# Altium schematic sheet IO_Ethernet.schdoc
size 265 x 180 mm
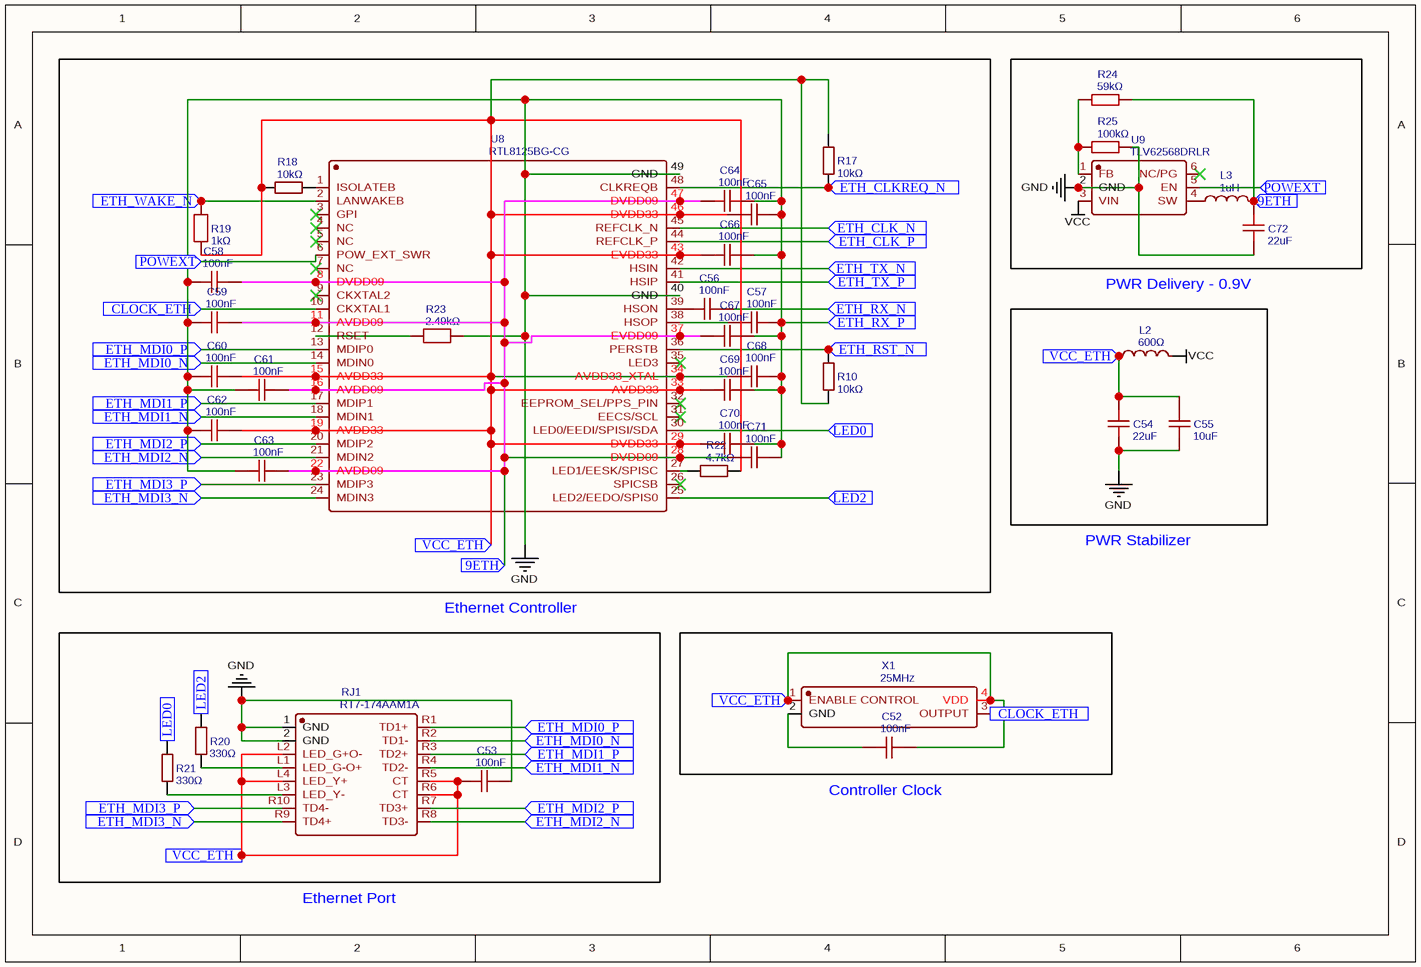
[diagram p0: IO_Ethernet.schdoc]

## Parts
C52  100nF  [C0402]
C53  100nF  [C0402]
C54  22uF  [C0805]
C55  10uF  [C0805]
C56  100nF  [C0402]
C57  100nF  [C0402]
C58  100nF  [C0402]
C59  100nF  [C0402]
C60  100nF  [C0402]
C61  100nF  [C0402]
C62  100nF  [C0402]
C63  100nF  [C0402]
C64  100nF  [C0402]
C65  100nF  [C0402]
C66  100nF  [C0402]
C67  100nF  [C0402]
C68  100nF  [C0402]
C69  100nF  [C0402]
C70  100nF  [C0402]
C71  100nF  [C0402]
C72  22uF  [C0805]
L2  600Ω  [L0805]
L3  1uH  [IND-SMD_L2.0-W1.6-B]
R10  10kΩ  [R0402]
R17  10kΩ  [R0402]
R18  10kΩ  [R0402]
R19  1kΩ  [R0402]
R20  330Ω  [R0402]
R21  330Ω  [R0402]
R22  4.7kΩ  [R0402]
R23  2.49kΩ  [R0402]
R24  59kΩ  [R0603]
R25  100kΩ  [R0603]
RJ1  RT7-174AAM1A  [RJ45-TH_RT7-174AAM1A]
U8  RTL8125BG-CG  [TQFN-48_L6.0-W6.0-P0.40-BL-EP4.5]
U9  TLV62568DRLR  [SOT-563_L1.6-W1.2-P0.50-LS1.6-BL]
X1  25MHz  [OSC-SMD_4P-L3.2-W2.5-BL_SG-8018CE]

## Blocks framed on the sheet
PWR Delivery - 0.9V: C54 C55 L2
Ethernet Controller: C53 R20 R21 RJ1

## Ports
9ETH (in), CLOCK_ETH (in), ETH_CLK_N (in), ETH_CLK_P (in), ETH_CLKREQ_N (in), ETH_MDI0_N (in), ETH_MDI0_P (in), ETH_MDI1_N (in), ETH_MDI1_P (in), ETH_MDI2_N (in), ETH_MDI2_P (in), ETH_MDI3_N (in), ETH_MDI3_P (in), ETH_RST_N (in), ETH_RX_N (in), ETH_RX_P (in), ETH_TX_N (in), ETH_TX_P (in), ETH_WAKE_N (in), LED0 (in), LED2 (in), POWEXT (in), VCC_ETH (in)

## Nets
GND: C53.2 C54.1 C55.1 C57.2 C58.2 C59.1 C60.1 C61.1 C62.1 C63.1 C64.2 C65.2 C66.2 C67.2 C68.2 C69.2 C70.2 C71.2 C72.1 R23.1 R25.2 RJ1.1(GND) RJ1.2(GND) U8.40(GND) U8.49(GND) U9.2(GND) ; port ETH_RX_P
VCC: L2.2 U9.3(VIN)
9ETH: C58.1 C59.2 C61.2 C63.2 C64.1 C67.1 C71.1 C72.2 L3.2 R24.2 U8.8(DVDD09) U8.11(AVDD09) U8.16(AVDD09) U8.22(AVDD09) U8.28(DVDD09) U8.37(EVDD09) U8.47(DVDD09) ; port 9ETH
CLOCK_ETH: U8.10(CKXTAL1) X1.3(OUTPUT) ; port CLOCK_ETH
ETH_CLK_N: U8.45(REFCLK_N) ; port ETH_CLK_N
ETH_CLK_P: U8.44(REFCLK_P) ; port ETH_CLK_P
ETH_CLKREQ_N: R17.1 U8.48(CLKREQB) ; port ETH_CLKREQ_N
ETH_MDI0_N: RJ1.R2(TD1-) U8.14(MDIN0) ; port ETH_MDI0_N
ETH_MDI0_P: RJ1.R1(TD1+) U8.13(MDIP0) ; port ETH_MDI0_P
ETH_MDI1_N: RJ1.R4(TD2-) U8.18(MDIN1) ; port ETH_MDI1_N
ETH_MDI1_P: RJ1.R3(TD2+) U8.17(MDIP1) ; port ETH_MDI1_P
ETH_MDI2_N: RJ1.R8(TD3-) U8.21(MDIN2) ; port ETH_MDI2_N
ETH_MDI2_P: RJ1.R7(TD3+) U8.20(MDIP2) ; port ETH_MDI2_P
ETH_MDI3_N: RJ1.R9(TD4+) U8.24(MDIN3) ; port ETH_MDI3_N
ETH_MDI3_P: RJ1.R10(TD4-) U8.23(MDIP3) ; port ETH_MDI3_P
ETH_RST_N: R10.2 U8.36(PERSTB) ; port ETH_RST_N
ETH_RX_N: C56.2 ; port ETH_RX_N
ETH_TX_N: U8.42(HSIN) ; port ETH_TX_N
ETH_TX_P: U8.41(HSIP) ; port ETH_TX_P
ETH_WAKE_N: R19.2 U8.2(LANWAKEB) ; port ETH_WAKE_N
LED0: R21.2 U8.30(LED0/EEDI/SPISI/SDA) ; port LED0
LED2: R20.1 U8.25(LED2/EEDO/SPIS0) ; port LED2
POWEXT: U8.6(POW_EXT_SWR) U9.5(EN) ; port POWEXT
VCC_ETH: C52.2 C53.1 C54.2 C55.2 C60.2 C62.2 C65.1 C66.1 C68.1 C69.1 C70.1 L2.1 R10.1 R17.2 R18.2 R19.1 R22.2 RJ1.L2(LED_G+O-) RJ1.L4(LED_Y+) RJ1.R5(CT) RJ1.R6(CT) U8.15(AVDD33) U8.19(AVDD33) U8.29(DVDD33) U8.33(AVDD33) U8.34(AVDD33_XTAL) U8.43(EVDD33) U8.46(DVDD33) X1.1(ENABLE_CONTROL) X1.4(VDD) ; port VCC_ETH
NetC52_1: C52.1 X1.2(GND)
NetC56_1: C56.1 U8.39(HSON)
NetC57_1: C57.1 U8.38(HSOP)
NetL3_1: L3.1 U9.4(SW)
NetR18_1: R18.1 U8.1(ISOLATEB)
NetR20_2: R20.2 RJ1.L1(LED_G-O+)
NetR21_1: R21.1 RJ1.L3(LED_Y-)
NetR22_1: R22.1 U8.27(LED1/EESK/SPISC)
NetR23_2: R23.2 U8.12(RSET)
NetR24_1: R24.1 R25.1 U9.1(FB)

Not connected (* = marked no-connect by the designer): U8 3(GPI)* 4(NC)* 5(NC)* 7(NC)* 9(CKXTAL2)* 26(SPICSB)* 31(EECS/SCL)* 32(EEPROM_SEL/PPS_PIN)* 35(LED3)*; U9 6(NC/PG)*

## Notes on the sheet
- PWR Stabilizer
- (near C52) Controller Clock
- Ethernet Port

## Library data of the parts
C52 C53 C56-C71 = 100nF: Manufacturer: muRata(村田); Manufacturer Part: GRM155R71H104KE14J; Contributor: lcsc; nameAlias: Value; Supplier: LCSC; Supplier Part: C2649519; JLCPCB Part Class: Extended Part; spicePre: C; spiceSymbolName: GRM155R71H104KE14J
C54 C72 = 22uF: Manufacturer: muRata(村田); Manufacturer Part: GRT21BR61E226ME13L; nameAlias: Value; Contributor: LCSC; Supplier: LCSC; Supplier Part: C398931; JLCPCB Part Class: Extended Part; spicePre: C; spiceSymbolName: GRT21BR61E226ME13L
C55 = 10uF: Manufacturer: CCTC(三环); Manufacturer Part: TCC0805X5R106K250FT; nameAlias: Value; Contributor: lcsc; Supplier: LCSC; Supplier Part: C5448891; JLCPCB Part Class: Extended Part; spicePre: C; spiceSymbolName: TCC0805X5R106K250FT
L2 = 600Ω: Manufacturer: TDK; Manufacturer Part: MPZ2012S601AT000; nameAlias: Value; Supplier: LCSC; Supplier Part: C21519; JLCPCB Part Class: Extended Part; spicePre: L; spiceSymbolName: MPZ2012S601AT000
L3 = 1uH: Manufacturer: XR(祥如); Manufacturer Part: XRIM201612S1R0MBCA; nameAlias: Value; Contributor: lcsc; Supplier: LCSC; Supplier Part: C22471099; JLCPCB Part Class: Extended Part; spicePre: L; spiceSymbolName: XRIM201612S1R0MBCA
R10 R17 R18 = 10kΩ: Manufacturer: PANASONIC(松下); Manufacturer Part: ERA2AEB103X; nameAlias: Value; Contributor: LCSC; Supplier: LCSC; Supplier Part: C191915; JLCPCB Part Class: Extended Part; spicePre: R; spiceSymbolName: ERA2AEB103X
R19 = 1kΩ: Manufacturer: YAGEO(国巨); Manufacturer Part: RT0402BRD071KL; Contributor: lcsc; nameAlias: Value; Supplier: LCSC; Supplier Part: C852624; JLCPCB Part Class: Extended Part; spicePre: R; spiceSymbolName: RT0402BRD071KL
R20 R21 = 330Ω: Manufacturer: YAGEO(国巨); Manufacturer Part: RC0402JR-07330RL; nameAlias: Value; Contributor: LCSC; Supplier: LCSC; Supplier Part: C105876; JLCPCB Part Class: Extended Part; spicePre: R; spiceSymbolName: RC0402JR-07330RL
R22 = 4.7kΩ: Manufacturer: YAGEO(国巨); Manufacturer Part: RC0402FR-074K7L; nameAlias: Value; Supplier: LCSC; Supplier Part: C105871; JLCPCB Part Class: Extended Part; spicePre: R; spiceSymbolName: RC0402FR-074K7L
R23 = 2.49kΩ: Manufacturer: FOJAN(富捷); Manufacturer Part: FRC0402F2491TS; nameAlias: Value; Contributor: lcsc; Supplier: LCSC; Supplier Part: C2933083; JLCPCB Part Class: Extended Part; spicePre: R; spiceSymbolName: FRC0402F2491TS
R24 = 59kΩ: Manufacturer: FH(风华); Manufacturer Part: RS-03K5902FT; nameAlias: Value; Contributor: LCSC; Supplier: LCSC; Supplier Part: C321955; JLCPCB Part Class: Extended Part; spicePre: R; spiceSymbolName: RS-03K5902FT
R25 = 100kΩ: Manufacturer: FH(风华); Manufacturer Part: RS-03K1003FT; nameAlias: Value; Contributor: LCSC; Supplier: LCSC; Supplier Part: C115320; JLCPCB Part Class: Extended Part; spicePre: R; spiceSymbolName: RS-03K1003FT_C115320
RJ1 = RT7-174AAM1A: Manufacturer: UDE(涌德电子); Contributor: LCSC; Supplier: LCSC; Supplier Part: C711505; Manufacturer Part: RT7-174AAM1A; JLCPCB Part Class: Extended Part; spicePre: R; spiceSymbolName: RT7-174AAM1A
U8 = RTL8125BG-CG: Manufacturer: REALTEK(瑞昱); Contributor: lcsc; Supplier: LCSC; Supplier Part: C3013605; Manufacturer Part: RTL8125BG-CG; JLCPCB Part Class: Extended Part; spicePre: U; spiceSymbolName: RTL8125BG-CG
U9 = TLV62568DRLR: Manufacturer: TI(德州仪器); Contributor: LCSC; Supplier: LCSC; Supplier Part: C398370; Manufacturer Part: TLV62568DRLR; JLCPCB Part Class: Extended Part; spicePre: U; spiceSymbolName: TLV62568DRLR
X1 = 25MHz: Manufacturer: SCTF(星通时频); Manufacturer Part: SX3M25.000B10G40TNN; nameAlias: Value; Contributor: lcsc; Supplier: LCSC; Supplier Part: C5452698; JLCPCB Part Class: Extended Part; spicePre: X; spiceSymbolName: SX3M25.000B10G40TNN